# Altium schematic sheet TEMPERATURE_SENSOR.SchDoc
size A; SheetNumber: 3; SheetTotal: 21
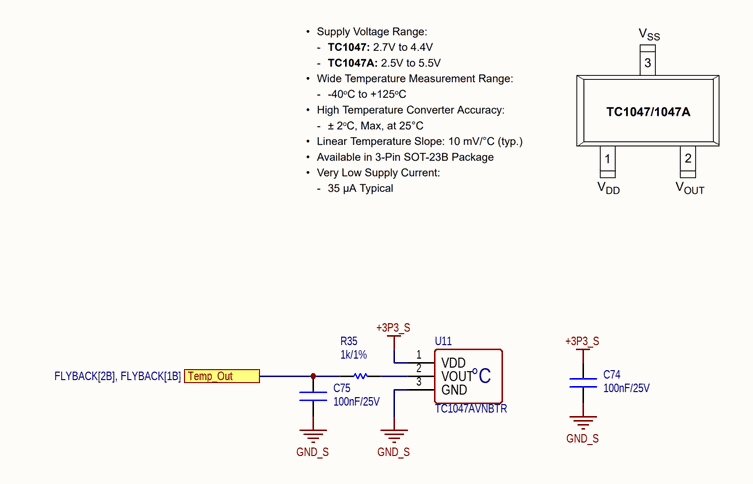
[diagram p0: TEMPERATURE_SENSOR.SchDoc]

## Parts
C74  100nF/25V  [CN-SMD-0603]
C75  100nF/25V  [CN-SMD-0603]
R35  1k/1%  [RES-SMD-0603]
U11  TC1047AVNBTR  [SOT23-132]

## Ports
Temp_Out (see FLYBACK[2B], FLYBACK[1B])

## Nets
+3P3_S: C74.2 U11.1(VDD)
GND_S: C74.1 C75.1 U11.3(GND)
Temp_Out: C75.2 R35.1 ; port Temp_Out
NetR35_2: R35.2 U11.2(VOUT)

## Notes on the sheet
- (in symbol TC1047AVNBTR) °C

## Library data of the parts
C74 C75 = CN: CL10B104KA8NNNC; PN: CL10B104KA8NNNC
R35 = Res-SMD: ERJ-3EKF1001V; Manufacturer: Generic Components; Class: Passive; PN: ERJ-3EKF1001V; Publisher: Altium Hobart Technology Centre
U11 = TC1047AVNBTR: Precision Temperature-to-Voltage Converter; PN: TC1047AVNBTR